# Altium schematic sheet 0143_FAN.SchDoc
size 848 x 558 mm
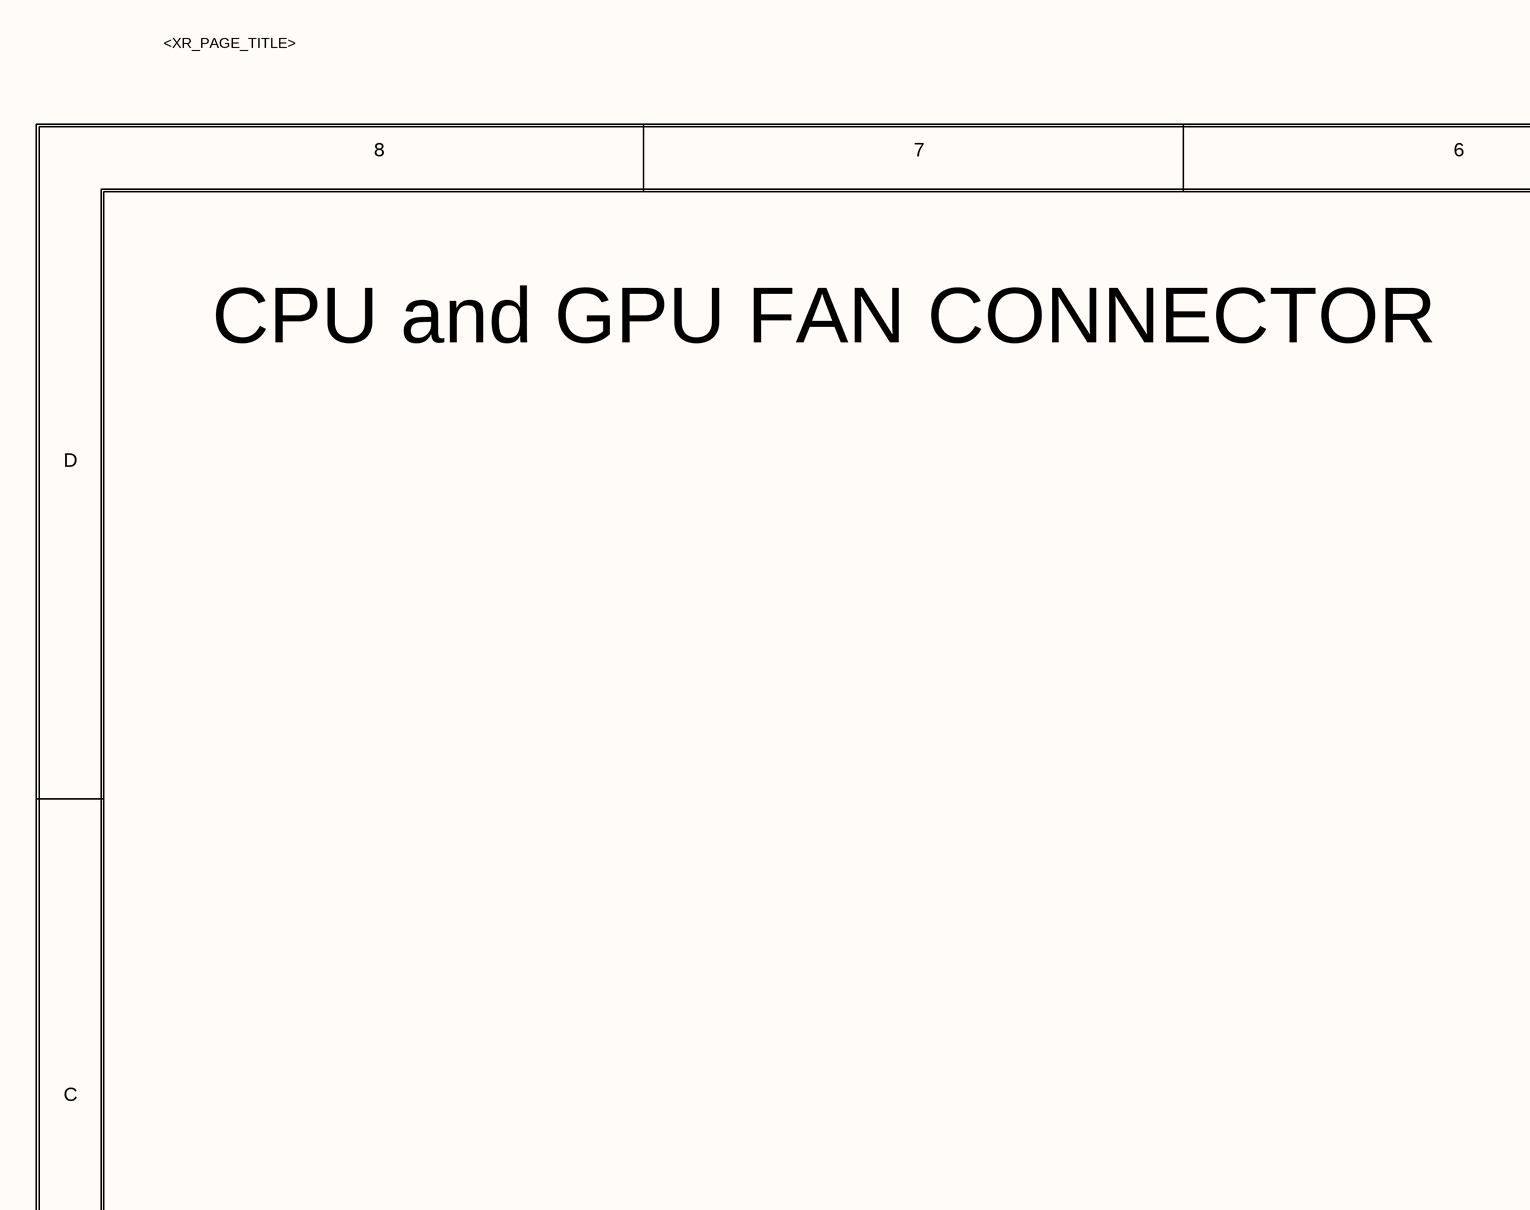
[diagram p0: 0143_FAN.SchDoc, top left]
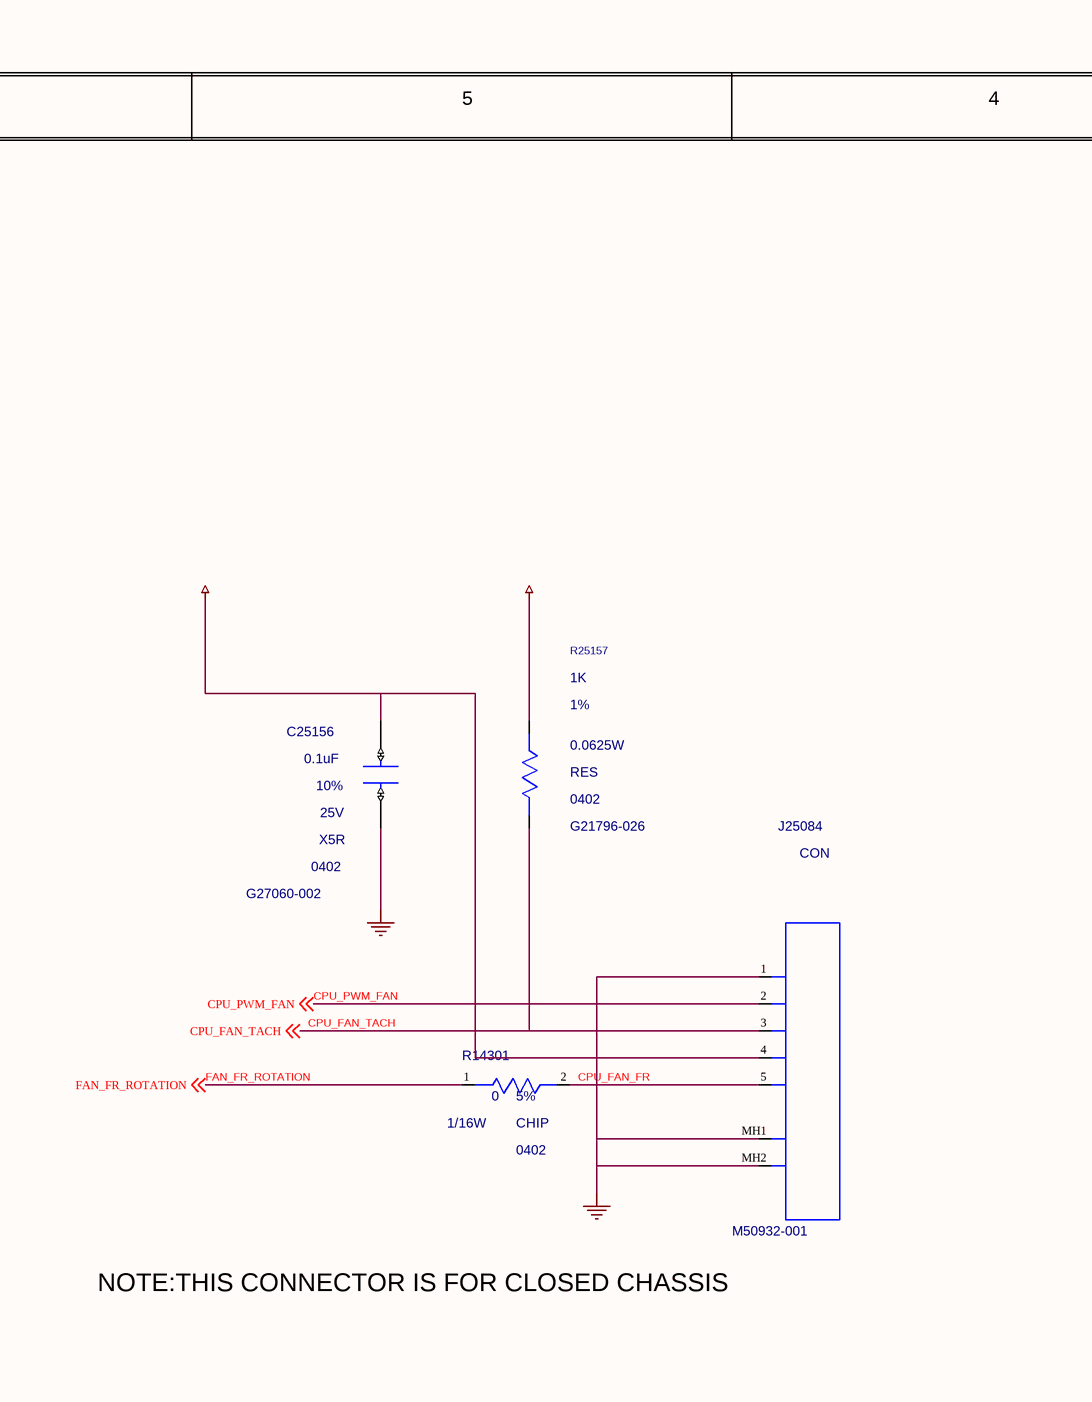
[diagram p1: 0143_FAN.SchDoc, top middle]
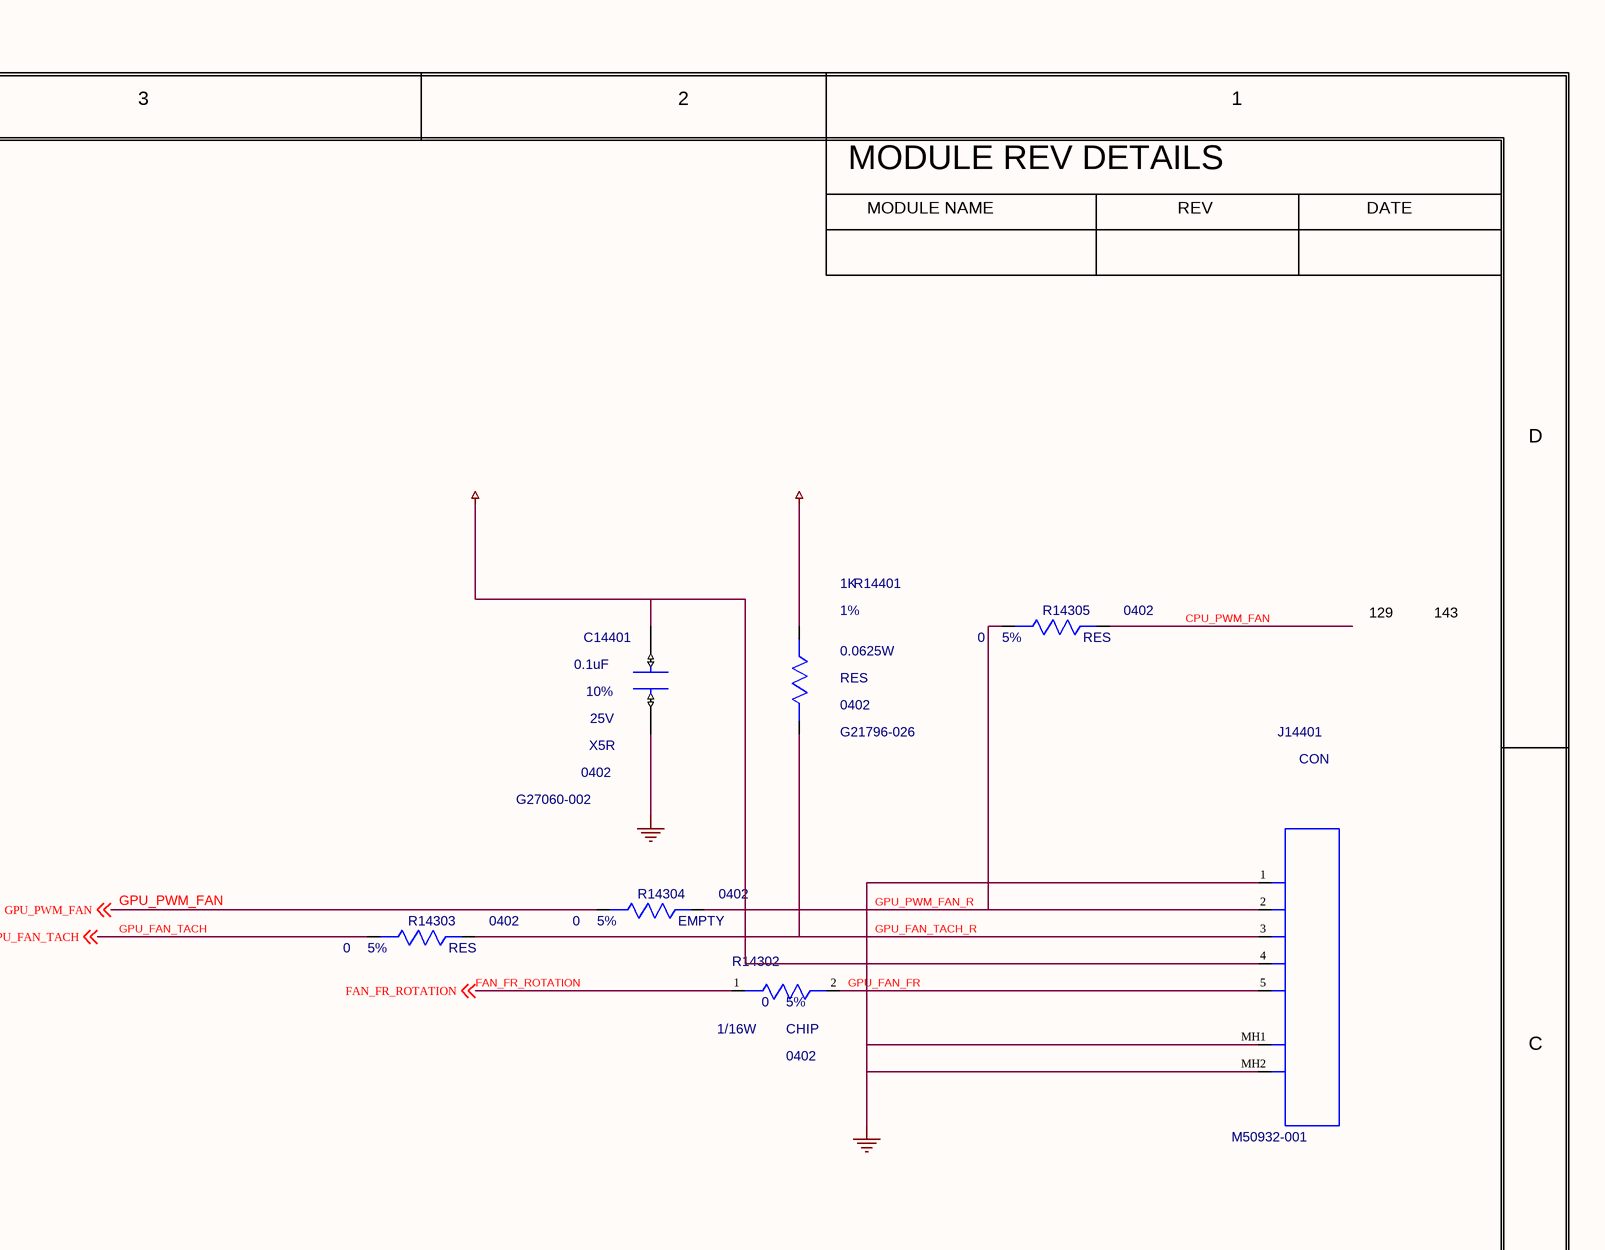
[diagram p2: 0143_FAN.SchDoc, top right]
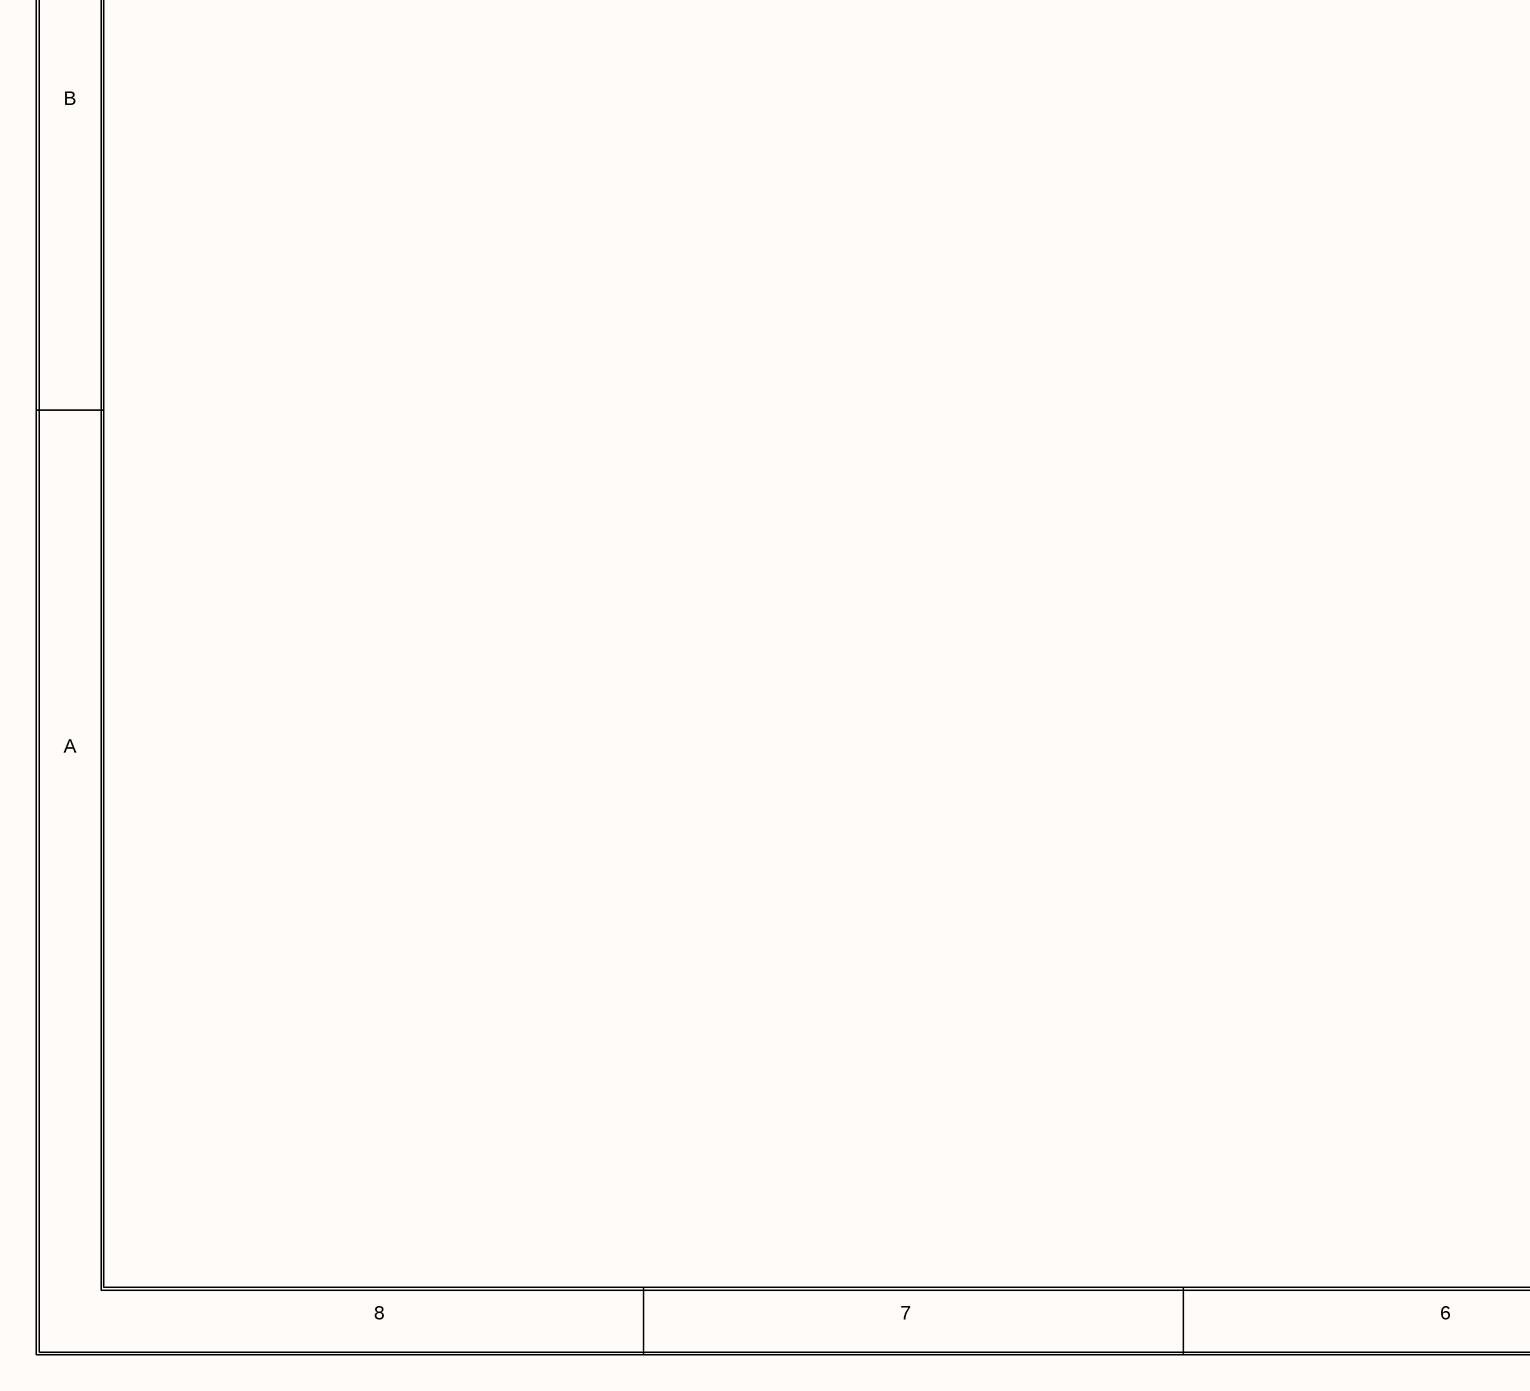
[diagram p3: 0143_FAN.SchDoc, bottom left]
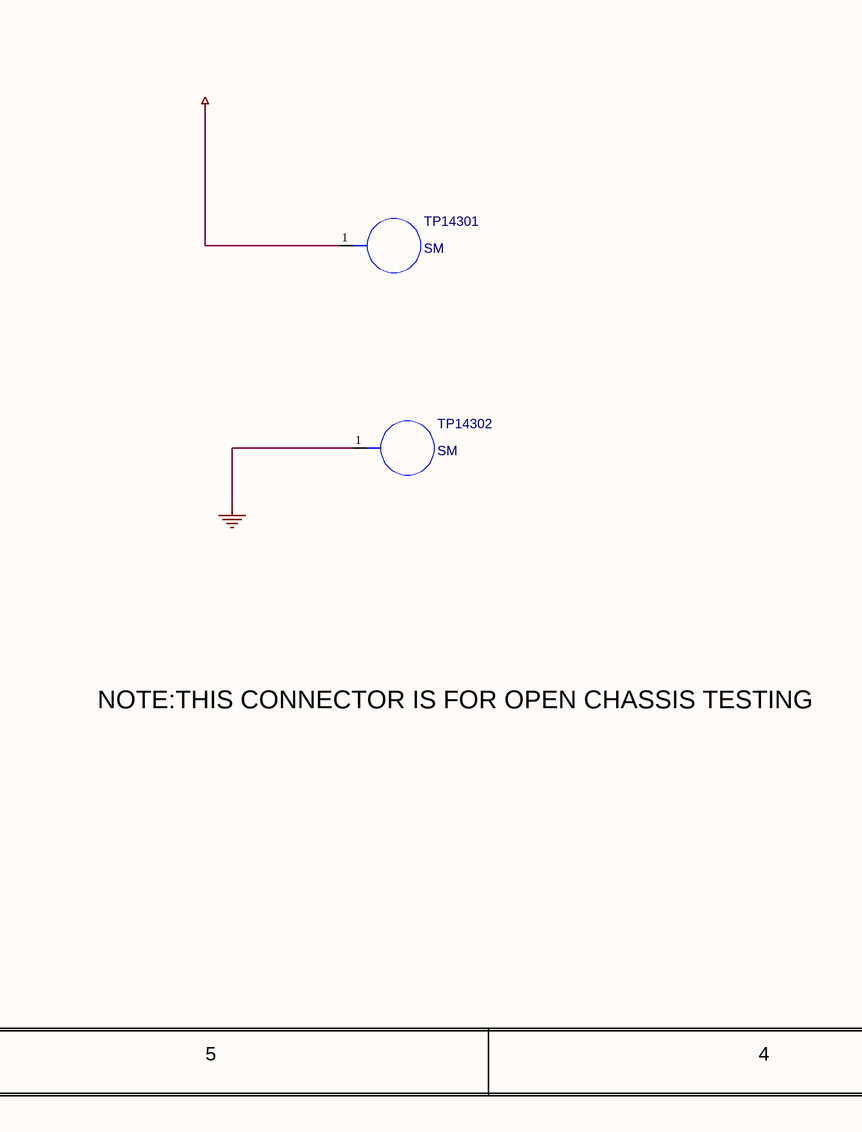
[diagram p4: 0143_FAN.SchDoc, bottom middle]
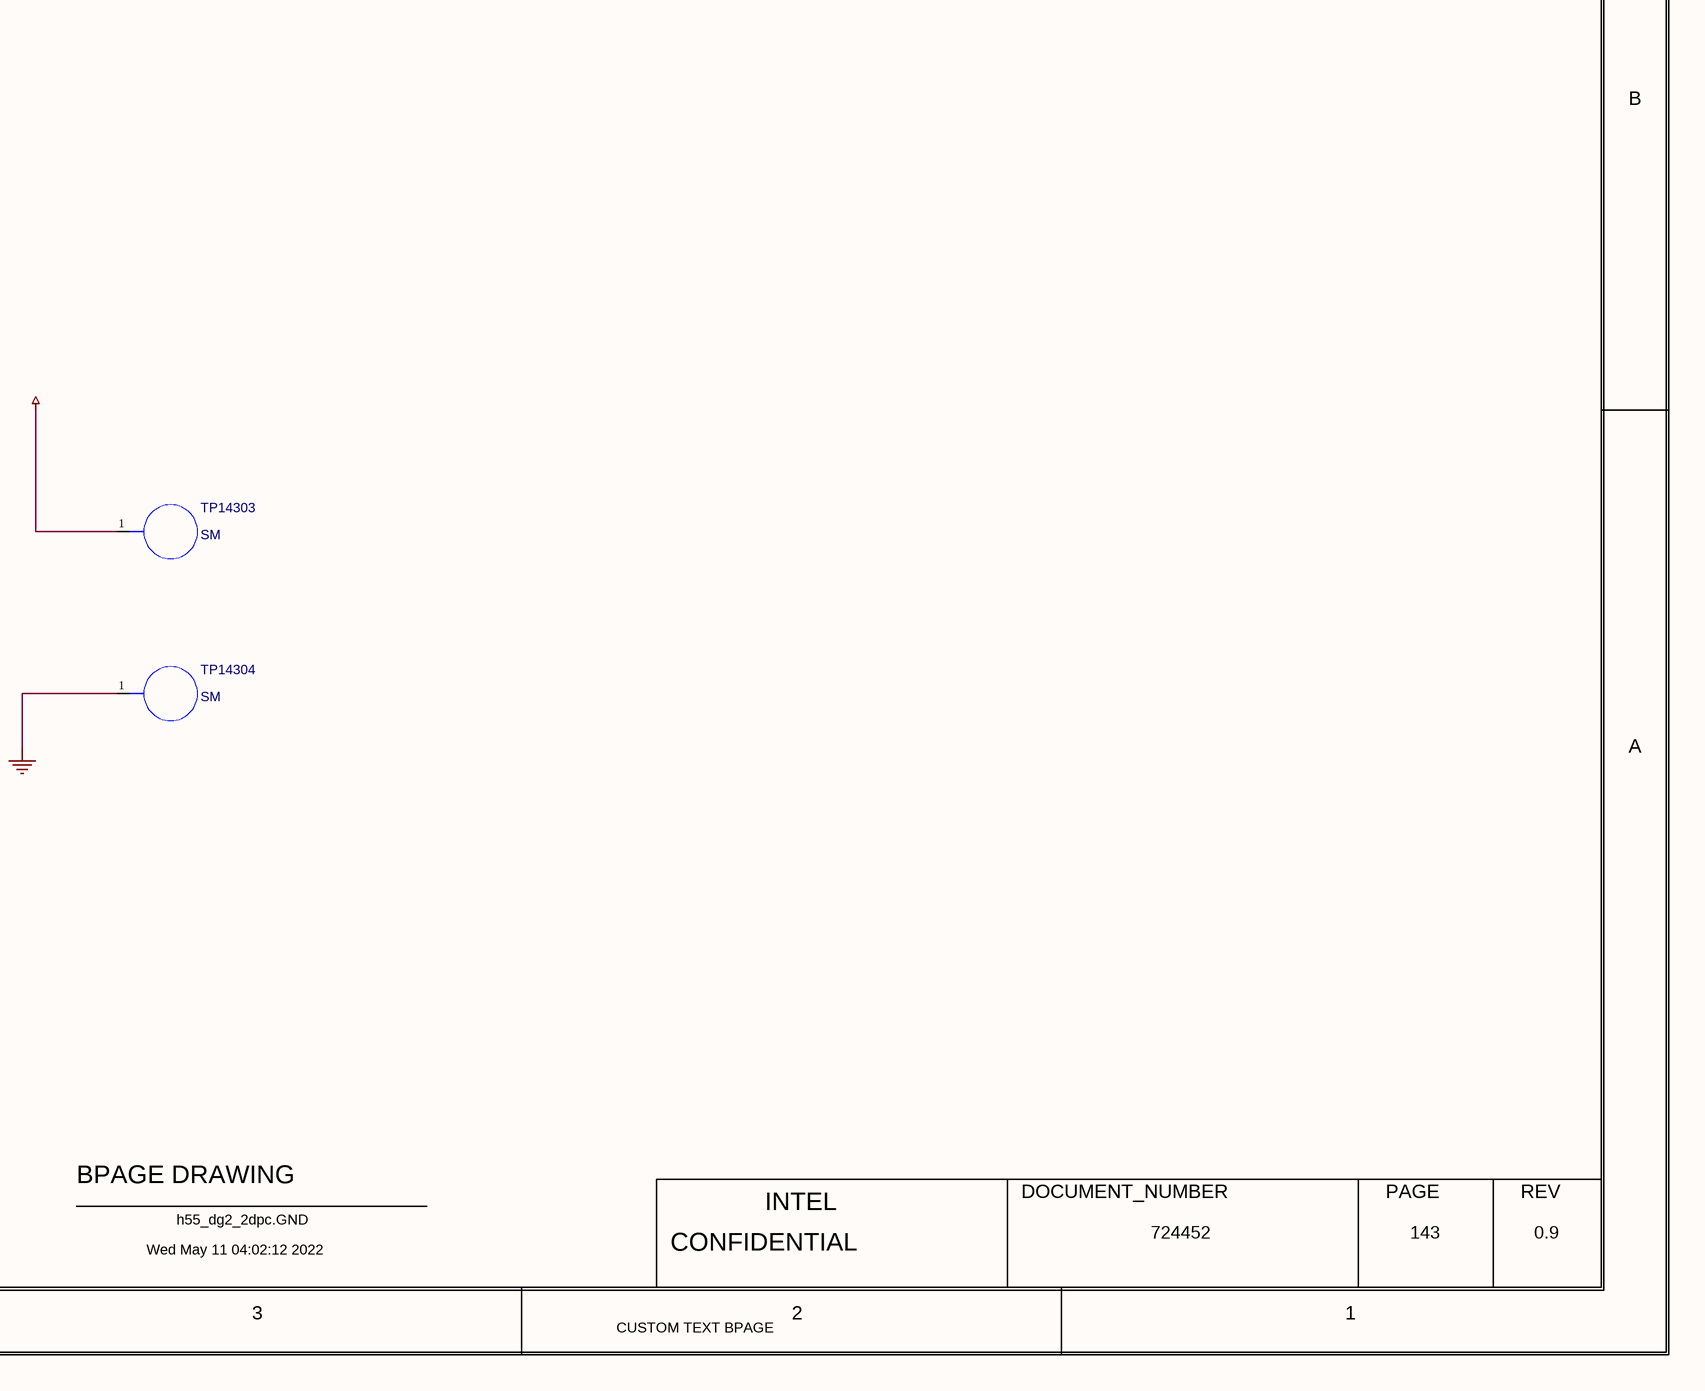
[diagram p5: 0143_FAN.SchDoc, bottom right]

## Parts
C14401  0.1uF  MATERIAL: X5R  PACK_TYPE: 0402  PART_NUMBER: G27060-002  TOLERANCE: 10%  VOLTAGE: 25V  [CTK2_SM0402_1050X550_MA]
C25156  0.1uF  MATERIAL: X5R  PACK_TYPE: 0402  PART_NUMBER: G27060-002  TOLERANCE: 10%  VOLTAGE: 25V  [CTK2_SM0402_1050X550_MA]
J14401  MATERIAL: CON  PART_NUMBER: M50932-001  [CTK0_B2B_SPR_1X5_2EM_1250_MA_PNP_VR]  (hidden comment: C_B2B_1X5_2EM)
J25084  MATERIAL: CON  PART_NUMBER: M50932-001  [CTK0_B2B_SPR_1X5_2EM_1250_MA_PNP_VR]  (hidden comment: C_B2B_1X5_2EM)
R14301  0  MATERIAL: CHIP  PACK_TYPE: 0402  TOLERANCE: 5%  WATTAGE: 1/16W  [SMR0402IA]
R14302  0  MATERIAL: CHIP  PACK_TYPE: 0402  TOLERANCE: 5%  WATTAGE: 1/16W  [SMR0402IA]
R14303  0  MATERIAL: RES  PACK_TYPE: 0402  TOLERANCE: 5%  [CTK2_SM0402_1100X550_MA]
R14304  0  MATERIAL: EMPTY  PACK_TYPE: 0402  TOLERANCE: 5%  [CTK2_SM0402_1100X550_MA]
R14305  0  MATERIAL: RES  PACK_TYPE: 0402  TOLERANCE: 5%  [CTK2_SM0402_1100X550_MA]
R14401  1K  MATERIAL: RES  PACK_TYPE: 0402  PART_NUMBER: G21796-026  TOLERANCE: 1%  WATTAGE: 0.0625W  [CTK0_SM0402_1100X550_MA]
R25157  1K  MATERIAL: RES  PACK_TYPE: 0402  PART_NUMBER: G21796-026  TOLERANCE: 1%  WATTAGE: 0.0625W  [CTK0_SM0402_1100X550_MA]
TP14301  PACK_TYPE: SM  [TPC30IA]  (hidden comment: TP)
TP14302  PACK_TYPE: SM  [TPC30IA]  (hidden comment: TP)
TP14303  PACK_TYPE: SM  [TPC30IA]  (hidden comment: TP)
TP14304  PACK_TYPE: SM  [TPC30IA]  (hidden comment: TP)

## Nets
+V3P3S: R14401.1(A) R25157.1(A)
+V12S_FAN: C14401.1(A) C25156.1(A) J14401.4(IO4) J25084.4(IO4) TP14301.1(TP) TP14303.1(TP)
GND: C14401.2(B) C25156.2(B) J14401.1(IO1) J14401.MH1 J14401.MH2 J25084.1(IO1) J25084.MH1 J25084.MH2 TP14302.1(TP) TP14304.1(TP)
CPU_FAN_FR: J25084.5(IO5) R14301.2(B)
CPU_FAN_TACH: J25084.3(IO3) R25157.2(B) ; off-sheet CPU_FAN_TACH
CPU_PWM_FAN: J25084.2(IO2) R14305.2(B) ; off-sheet CPU_PWM_FAN
FAN_FR_ROTATION: R14301.1(A) R14302.1(A) ; off-sheet FAN_FR_ROTATION
GPU_FAN_FR: J14401.5(IO5) R14302.2(B)
GPU_FAN_TACH: R14303.1(A) ; off-sheet GPU_FAN_TACH
GPU_FAN_TACH_R: J14401.3(IO3) R14303.2(B) R14401.2(B)
GPU_PWM_FAN: R14304.1(A) ; off-sheet GPU_PWM_FAN
GPU_PWM_FAN_R: J14401.2(IO2) R14304.2(B) R14305.1(A)

## Notes on the sheet
- <XR_PAGE_TITLE>
- 8
- 7
- 6
- 5
- 4
- 3
- 2
- 1
- MODULE REV DETAILS
- MODULE NAME
- REV
- DATE
- CPU and GPU FAN CONNECTOR
- D
- 129
- 143
- C
- NOTE:THIS CONNECTOR IS FOR CLOSED CHASSIS
- B
- A
- NOTE:THIS CONNECTOR IS FOR OPEN CHASSIS TESTING
- BPAGE DRAWING
- INTEL
- DOCUMENT_NUMBER
- PAGE
- Wed May 11 04:02:12 2022
- h55_dg2_2dpc.GND
- CONFIDENTIAL
- 724452
- 0.9
- CUSTOM TEXT BPAGE

## Library data of the parts
C14401 = C_CAP: CDS_PHYS_PART_NAME: C_CAP_0402-G27060-002,X5R,0.1UF,25V,10%,TK2,GENERIC; CDS_LMAN_SYM_OUTLINE: -50,50,50,-50; FP_TECH: TK2; IP: GENERIC; ROOM: NONE; OriginalSymbolOrigin: (-50,25); XY: (-1575,4000); VER: 1; ROT: 0; PHYS_PAGE: 143; LOCATION: C14401; DRAWING: @RVP1_ADL_SB_ADP_S_DDR5_SODIMM_2DPC_LIB.H55_DG2_2DPC(SCH_1):PAGE512; CDS_LIB: c_discrete; VARIANT: ?; PCB Footprint: CTK2_SM0402_1050X550_MA; CHIPS_PART_NAME: C_CAP; CDS_PART_NAME: C_CAP_0402-G27060-002,X5R,0.1UF,25V,10%,TK2,GENERIC; CDS_LOCATION: C14401
C25156 = C_CAP: CDS_PHYS_PART_NAME: C_CAP_0402-G27060-002,X5R,0.1UF,25V,10%,TK2,GENERIC; CDS_LMAN_SYM_OUTLINE: -50,50,50,-50; FP_TECH: TK2; IP: GENERIC; ROOM: NONE; OriginalSymbolOrigin: (-50,25); XY: (-4650,3825); VER: 1; ROT: 0; PHYS_PAGE: 143; LOCATION: C25156; DRAWING: @RVP1_ADL_SB_ADP_S_DDR5_SODIMM_2DPC_LIB.H55_DG2_2DPC(SCH_1):PAGE512; CDS_LIB: c_discrete; VARIANT: ?; PCB Footprint: CTK2_SM0402_1050X550_MA; CHIPS_PART_NAME: C_CAP; CDS_PART_NAME: C_CAP_0402-G27060-002,X5R,0.1UF,25V,10%,TK2,GENERIC; CDS_LOCATION: C25156
J14401 = C_B2B_1X5_2EM: CDS_PHYS_PART_NAME: C_B2B_1X5_2EM_SM-M50932-001,CON,B2B_1X5_2EM,TK0,GENERIC; CDS_LMAN_SYM_OUTLINE: -50,300,50,-250; FP_TECH: TK0; IP: GENERIC; PACK_TYPE: SM; ROOM: NONE; OriginalSymbolOrigin: (-50,300); XY: (-350,3425); VER: 1; ROT: 2; PHYS_PAGE: 143; LOCATION: J14401; DRAWING: @RVP1_ADL_SB_ADP_S_DDR5_SODIMM_2DPC_LIB.H55_DG2_2DPC(SCH_1):PAGE512; CDS_LIB: local; VARIANT: ?; PCB Footprint: CTK0_B2B_SPR_1X5_2EM_1250_MA_PNP_VR; CHIPS_PART_NAME: C_B2B_1X5_2EM; CDS_PART_NAME: C_B2B_1X5_2EM_SM-M50932-001,CON,B2B_1X5_2EM,TK0,GENERIC; CDS_LOCATION: J14401
J25084 = C_B2B_1X5_2EM: CDS_PHYS_PART_NAME: C_B2B_1X5_2EM_SM-M50932-001,CON,B2B_1X5_2EM,TK0,GENERIC; CDS_LMAN_SYM_OUTLINE: -50,300,50,-250; FP_TECH: TK0; IP: GENERIC; PACK_TYPE: SM; ROOM: NONE; OriginalSymbolOrigin: (-50,300); XY: (-3850,3250); VER: 1; ROT: 2; PHYS_PAGE: 143; LOCATION: J25084; DRAWING: @RVP1_ADL_SB_ADP_S_DDR5_SODIMM_2DPC_LIB.H55_DG2_2DPC(SCH_1):PAGE512; CDS_LIB: local; VARIANT: ?; PCB Footprint: CTK0_B2B_SPR_1X5_2EM_1250_MA_PNP_VR; CHIPS_PART_NAME: C_B2B_1X5_2EM; CDS_PART_NAME: C_B2B_1X5_2EM_SM-M50932-001,CON,B2B_1X5_2EM,TK0,GENERIC; CDS_LOCATION: J25084
R14301 = RES#1: PART_NUMBER: G64084-001; CHIPS_PART_NAME: RES; CDS_PHYS_PART_NAME: RES_0402-G64084-001,CHIP,0,5%,1/16W,LPDB,GENERIC; OriginalSymbolOrigin: (-75,25); XY: (-4400,3250); VER: 1; PHYS_PAGE: 143; LOCATION: R14301; IP: GENERIC; FP_TECH: LPDB; DRAWING: @RVP1_ADL_SB_ADP_S_DDR5_SODIMM_2DPC_LIB.H55_DG2_2DPC(SCH_1):PAGE512; CDS_LIB: discrete; PCB Footprint: SMR0402IA; ROT: 0; CDS_PART_NAME: RES_0402-G64084-001,CHIP,0,5%,1/16W,LPDB,GENERIC; CDS_LOCATION: R14301
R14302 = RES#1: PART_NUMBER: G64084-001; CHIPS_PART_NAME: RES; CDS_PHYS_PART_NAME: RES_0402-G64084-001,CHIP,0,5%,1/16W,LPDB,GENERIC; OriginalSymbolOrigin: (-75,25); XY: (-1325,3425); VER: 1; PHYS_PAGE: 143; LOCATION: R14302; IP: GENERIC; FP_TECH: LPDB; DRAWING: @RVP1_ADL_SB_ADP_S_DDR5_SODIMM_2DPC_LIB.H55_DG2_2DPC(SCH_1):PAGE512; CDS_LIB: discrete; PCB Footprint: SMR0402IA; ROT: 0; CDS_PART_NAME: RES_0402-G64084-001,CHIP,0,5%,1/16W,LPDB,GENERIC; CDS_LOCATION: R14302
R14303 = C_RES#1: PART_NUMBER: C75811-002; CHIPS_PART_NAME: C_RES; CDS_PHYS_PART_NAME: C_RES_0402-C75811-002,RES,0,5%,0.0625W,TK2,GENERIC; CDS_LMAN_SYM_OUTLINE: -50,50,50,-50; FP_TECH: TK2; IP: GENERIC; ROOM: NONE; WATTAGE: 0.0625W; OriginalSymbolOrigin: (-75,25); XY: (-2000,3525); VER: 1; PHYS_PAGE: 143; LOCATION: R14303; DRAWING: @RVP1_ADL_SB_ADP_S_DDR5_SODIMM_2DPC_LIB.H55_DG2_2DPC(SCH_1):PAGE512; CDS_LIB: c_discrete; VARIANT: ?; PCB Footprint: CTK2_SM0402_1100X550_MA; ROT: 0; CDS_PART_NAME: C_RES_0402-C75811-002,RES,0,5%,0.0625W,TK2,GENERIC; CDS_LOCATION: R14303
R14304 = C_RES#1: PART_NUMBER: C75811-002; CHIPS_PART_NAME: C_RES; CDS_PHYS_PART_NAME: C_RES_0402-C75811-002,EMPTY,0,5%,0.0625W,TK2,GENERIC; CDS_LMAN_SYM_OUTLINE: -50,50,50,-50; FP_TECH: TK2; IP: GENERIC; ROOM: NONE; WATTAGE: 0.0625W; OriginalSymbolOrigin: (-75,25); XY: (-1575,3575); VER: 1; PHYS_PAGE: 143; LOCATION: R14304; DRAWING: @RVP1_ADL_SB_ADP_S_DDR5_SODIMM_2DPC_LIB.H55_DG2_2DPC(SCH_1):PAGE512; CDS_LIB: c_discrete; VARIANT: ?; PCB Footprint: CTK2_SM0402_1100X550_MA; ROT: 0; CDS_PART_NAME: C_RES_0402-C75811-002,EMPTY,0,5%,0.0625W,TK2,GENERIC; CDS_LOCATION: R14304
R14305 = C_RES#1: PART_NUMBER: C75811-002; CHIPS_PART_NAME: C_RES; CDS_PHYS_PART_NAME: C_RES_0402-C75811-002,RES,0,5%,0.0625W,TK2,GENERIC; CDS_LMAN_SYM_OUTLINE: -50,50,50,-50; FP_TECH: TK2; IP: GENERIC; ROOM: NONE; WATTAGE: 0.0625W; OriginalSymbolOrigin: (-75,25); XY: (-825,4100); VER: 1; PHYS_PAGE: 143; LOCATION: R14305; DRAWING: @RVP1_ADL_SB_ADP_S_DDR5_SODIMM_2DPC_LIB.H55_DG2_2DPC(SCH_1):PAGE512; CDS_LIB: c_discrete; VARIANT: ?; PCB Footprint: CTK2_SM0402_1100X550_MA; ROT: 0; CDS_PART_NAME: C_RES_0402-C75811-002,RES,0,5%,0.0625W,TK2,GENERIC; CDS_LOCATION: R14305
R14401 = C_RES: CDS_PHYS_PART_NAME: C_RES_0402-G21796-026,RES,1K,1%,0.0625W,TK0,GENERIC; CDS_LMAN_SYM_OUTLINE: -50,50,50,-50; FP_TECH: TK0; IP: GENERIC; ROOM: NONE; OriginalSymbolOrigin: (-25,75); XY: (-1300,4000); VER: 2; SUB_ROOM_2: FAN; SUB_ROOM_1: THERMAL; SUB_ROOM: PUPD; ROT: 0; PHYS_PAGE: 143; LOCATION: R14401; DRAWING: @RVP1_ADL_SB_ADP_S_DDR5_SODIMM_2DPC_LIB.H55_DG2_2DPC(SCH_1):PAGE512; CDS_LIB: c_discrete; VARIANT: ?; PCB Footprint: CTK0_SM0402_1100X550_MA; CHIPS_PART_NAME: C_RES; CDS_PART_NAME: C_RES_0402-G21796-026,RES,1K,1%,0.0625W,TK0,GENERIC; CDS_LOCATION: R14401
R25157 = C_RES: CDS_PHYS_PART_NAME: C_RES_0402-G21796-026,RES,1K,1%,0.0625W,TK0,GENERIC; CDS_LMAN_SYM_OUTLINE: -50,50,50,-50; FP_TECH: TK0; IP: GENERIC; ROOM: NONE; OriginalSymbolOrigin: (-25,75); XY: (-4375,3825); VER: 2; SUB_ROOM_2: FAN; SUB_ROOM_1: THERMAL; SUB_ROOM: PUPD; ROT: 0; PHYS_PAGE: 143; LOCATION: R25157; DRAWING: @RVP1_ADL_SB_ADP_S_DDR5_SODIMM_2DPC_LIB.H55_DG2_2DPC(SCH_1):PAGE512; CDS_LIB: c_discrete; VARIANT: ?; PCB Footprint: CTK0_SM0402_1100X550_MA; CHIPS_PART_NAME: C_RES; CDS_PART_NAME: C_RES_0402-G21796-026,RES,1K,1%,0.0625W,TK0,GENERIC; CDS_LOCATION: R25157
TP14301 = TP#2: PART_NUMBER: NA_63939; CDS_PHYS_PART_NAME: TP_SM-NA_63939,EMPTY,TPC30IA,LPDB,GENERIC; CDS_LMAN_SYM_OUTLINE: -50,50,50,-50; OriginalSymbolOrigin: (-75,50); XY: (-4175,1450); VER: 1; ROT: 0; PHYS_PAGE: 143; LOCATION: TP14301; IP: GENERIC; FP_TECH: LPDB; DRAWING: @RVP1_ADL_SB_ADP_S_DDR5_SODIMM_2DPC_LIB.H55_DG2_2DPC(SCH_1):PAGE512; CDS_LIB: board_artifacts; MATERIAL: EMPTY; PCB Footprint: TPC30IA; CHIPS_PART_NAME: TP; CDS_PART_NAME: TP_SM-NA_63939,EMPTY,TPC30IA,LPDB,GENERIC; CDS_LOCATION: TP14301
TP14302 = TP#2: PART_NUMBER: NA_63939; CDS_PHYS_PART_NAME: TP_SM-NA_63939,EMPTY,TPC30IA,LPDB,GENERIC; CDS_LMAN_SYM_OUTLINE: -50,50,50,-50; OriginalSymbolOrigin: (-75,50); XY: (-4150,1075); VER: 1; ROT: 0; PHYS_PAGE: 143; LOCATION: TP14302; IP: GENERIC; FP_TECH: LPDB; DRAWING: @RVP1_ADL_SB_ADP_S_DDR5_SODIMM_2DPC_LIB.H55_DG2_2DPC(SCH_1):PAGE512; CDS_LIB: board_artifacts; MATERIAL: EMPTY; PCB Footprint: TPC30IA; CHIPS_PART_NAME: TP; CDS_PART_NAME: TP_SM-NA_63939,EMPTY,TPC30IA,LPDB,GENERIC; CDS_LOCATION: TP14302
TP14303 = TP#2: PART_NUMBER: NA_63939; CDS_PHYS_PART_NAME: TP_SM-NA_63939,EMPTY,TPC30IA,LPDB,GENERIC; CDS_LMAN_SYM_OUTLINE: -50,50,50,-50; OriginalSymbolOrigin: (-75,50); XY: (-2650,1400); VER: 1; ROT: 0; PHYS_PAGE: 143; LOCATION: TP14303; IP: GENERIC; FP_TECH: LPDB; DRAWING: @RVP1_ADL_SB_ADP_S_DDR5_SODIMM_2DPC_LIB.H55_DG2_2DPC(SCH_1):PAGE512; CDS_LIB: board_artifacts; MATERIAL: EMPTY; PCB Footprint: TPC30IA; CHIPS_PART_NAME: TP; CDS_PART_NAME: TP_SM-NA_63939,EMPTY,TPC30IA,LPDB,GENERIC; CDS_LOCATION: TP14303
TP14304 = TP#2: PART_NUMBER: NA_63939; CDS_PHYS_PART_NAME: TP_SM-NA_63939,EMPTY,TPC30IA,LPDB,GENERIC; CDS_LMAN_SYM_OUTLINE: -50,50,50,-50; OriginalSymbolOrigin: (-75,50); XY: (-2650,1100); VER: 1; ROT: 0; PHYS_PAGE: 143; LOCATION: TP14304; IP: GENERIC; FP_TECH: LPDB; DRAWING: @RVP1_ADL_SB_ADP_S_DDR5_SODIMM_2DPC_LIB.H55_DG2_2DPC(SCH_1):PAGE512; CDS_LIB: board_artifacts; MATERIAL: EMPTY; PCB Footprint: TPC30IA; CHIPS_PART_NAME: TP; CDS_PART_NAME: TP_SM-NA_63939,EMPTY,TPC30IA,LPDB,GENERIC; CDS_LOCATION: TP14304